# Altium schematic sheet Decoupling Capacitors.SchDoc
size A4
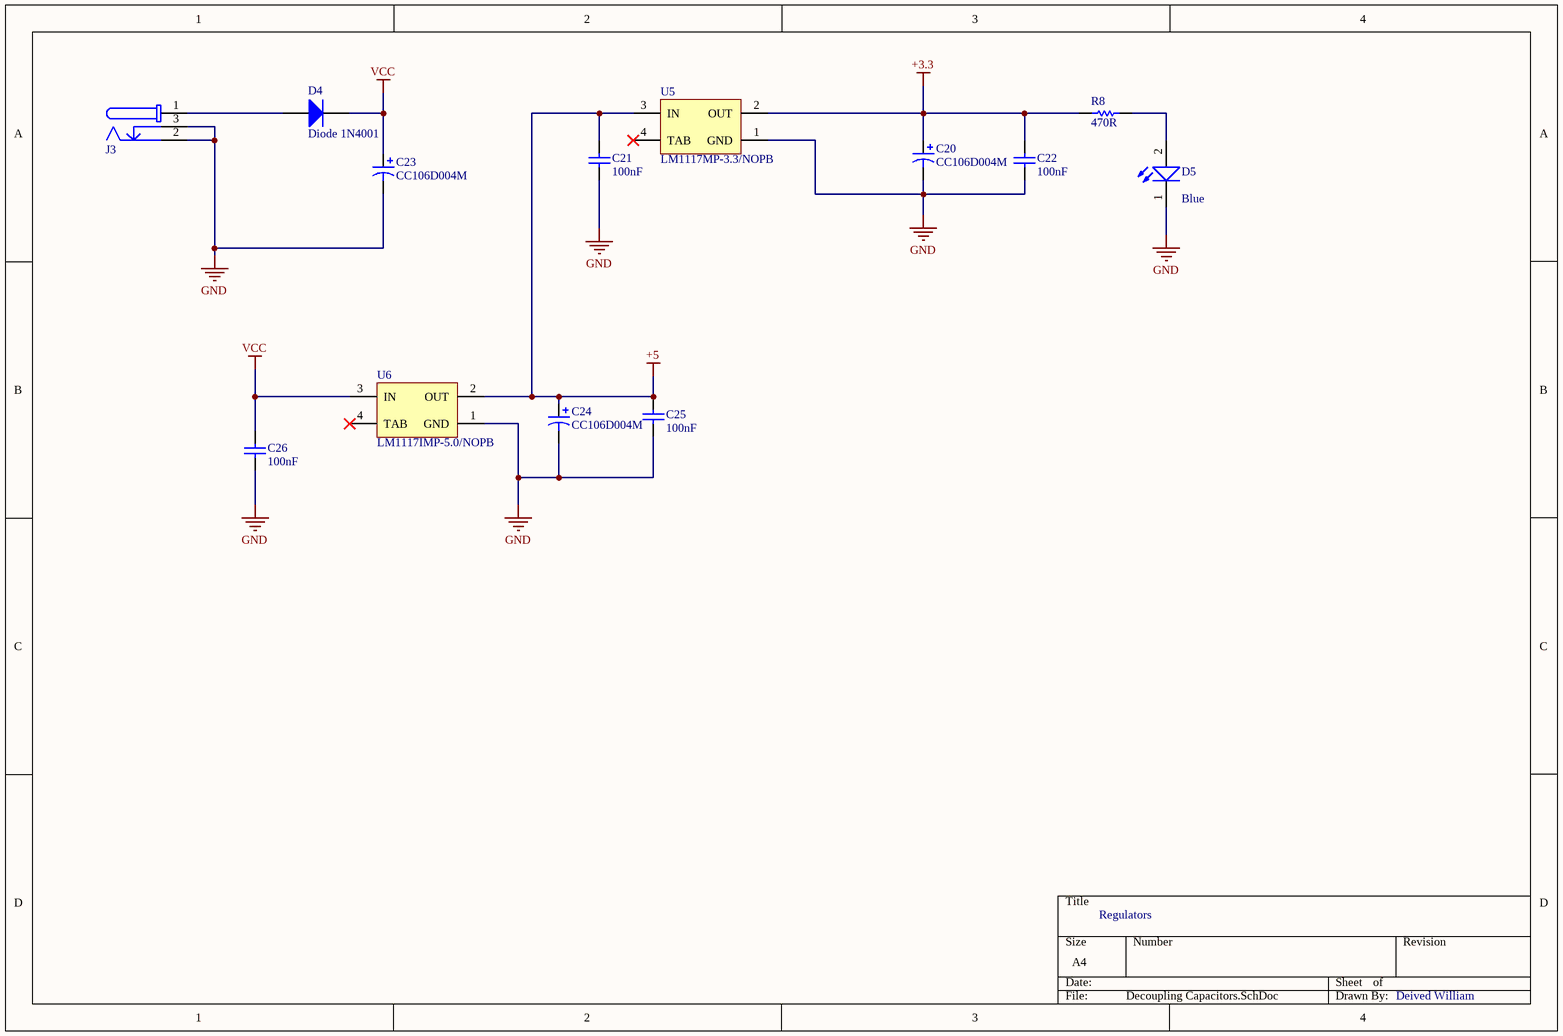
[diagram p0: Decoupling Capacitors.SchDoc]

## Parts
C20  CC106D004M  [D]
C21  value 100nF  [WCAP-CSGP_0603, 1.6x0.8x0.8mm_Reflow]  (hidden comment: 885012206020)
C22  value 100nF  [WCAP-CSGP_0603, 1.6x0.8x0.8mm_Reflow]  (hidden comment: 885012206020)
C23  CC106D004M  [D]
C24  CC106D004M  [D]
C25  value 100nF  [WCAP-CSGP_0603, 1.6x0.8x0.8mm_Reflow]  (hidden comment: 885012206020)
C26  value 100nF  [WCAP-CSGP_0603, 1.6x0.8x0.8mm_Reflow]  (hidden comment: 885012206020)
D4  Diode 1N4001  [DO-41]
D5  Emitting Color: Blue  [WL-SMCW_0805]  (hidden comment: 150080BS75000)
J3  694108301002  [694108301002]  (value not drawn)
R8  470R  [3-0603]
U5  LM1117MP-3.3/NOPB  [MP04A_N]
U6  LM1117IMP-5.0/NOPB  [MP04A_N]

## Nets
+3.3: C20.1 C22.2 R8.1 U5.2(OUT)
+5: C21.2 C24.1 C25.2 U5.3(IN) U6.2(OUT)
GND: C20.2 C21.1 C22.1 C23.2 C24.2 C25.1 C26.1 D5.1(K) J3.2 J3.3 U5.1(GND) U6.1(GND)
VCC: C23.1 C26.2 D4.2(K) U6.3(IN)
NetD4_1: D4.1(A) J3.1
NetD5_2: D5.2(A) R8.2

Not connected (* = marked no-connect by the designer): U5 4(TAB)*; U6 4(TAB)*

## Notes on the sheet
- Regulators
- Deived William

## Library data of the parts
C20 C23 C24 = CC106D004M: Conformal Coated Solid Tantalum Chip Capacitor: Standard Range, 10uF, 20% Tolerance, 4 WVDC @ -55°C to +85°C, Surge = 5V; Note: See Data Sheet for full range of components; Published: 19-Mar-2004; DatasheetDocument: 21-Mar-2002; PackageReference: D; Publisher: Altium Limited; ComponentLink1Description: Manufacturer Link; ComponentLink1URL: http://www.vishay.com/; ComponentLink2Description: Datasheet; ComponentLink2URL: http://www.vishay.com/docs/43017/ccec.pdf; Value: 10uF
C21 C22 C25 C26 = 885012206020: WCAP-CSGP Ceramic Capacitors, size 0603, 1.6x0.8x0.8mm, 10V, X7R, 100nF; Rated Voltage: 10V DC; ComponentLink1Description: Manufacturer; ComponentLink1URL: http://www.we-online.de; ComponentLink2Description: Datasheet; ComponentLink2URL: http://katalog.we-online.de/pbs/datasheet/885012206020.pdf; Part Number: 885012206020; Published Date: June 2017; Publisher: Wurth Elektronik; Size: 0603, 1.6x0.8x0.8mm; Ceramic Type: X7R
D4 = Diode 1N4001: 1 Amp General Purpose Rectifier; Published: 8-Jun-2000; LatestRevisionDate: 17-Jul-2002; LatestRevisionNote: Re-released for DXP Platform.; DatasheetVersion: 1998; PackageVersion: Aug-1999; PackageReference: DO-41; Publisher: Altium Limited; PackageDescription: Diode, Axial; Body 5.2 x 2.7 mm (LxDia. max), Lead Dia. 0.86 mm (max); Code_JEDEC: DO-204-AL; ComponentLink1Description: Manufacturer Link; ComponentLink1URL: http://www.fairchildsemi.com/; ComponentLink2Description: Datasheet; ComponentLink2URL: http://www.fairchildsemi.com/ds/1N%2F1N4001.pdf
D5 = 150080BS75000: WL-SMCW SMD Mono-color Chip LED Waterclear, size 0805, Blue; Forward Voltage: 3.2 V; Viewing Angle: 140°; Peak Wavelength: 465 nm; Published Date: Jan 2017; Publisher: Wurth Elektronik; ComponentLink1Description: Manufacturer; ComponentLink1URL: http://www.we-online.de; ComponentLink2Description: Datasheet; ComponentLink2URL: http://katalog.we-online.de/led/datasheet/150080BS75000.pdf; Part Number: 150080BS75000; Size: 0805
J3 = 694108301002: DC Power Jack Right Angled(6.4) WR-DC; Plug OD: 5.5 mm; Rated Current: 5 A; Working Voltage: 24 VAC; Withstanding Voltage: 500 VAC; Opening Diameter: 6.4 mm; ComponentLink1Description: Manufacturer; ComponentLink1URL: http://www.we-online.de; ComponentLink2Description: Datasheet; ComponentLink2URL: http://katalog.we-online.com/em/datasheet/6941xx301002.pdf; Part Number: 694108301002; Published Date: September 2017; Publisher: Wurth Elektronik
R8 = ERJ3RE: Precision Thick Film Chip Resistor, 10 Ohm to 1M Ohm Range, 1% and 0.5% Tolerance, 0603 Size, 0.063 W; Published: 17-Dec-2003; LatestRevisionDate: 19-Mar-2004; LatestRevisionNote: Silkscreen size reduced.; PackageDocument: Mar-2003; PackageReference: 3-0603; Publisher: Altium Limited; Code_IPC: 1608 [0603]; ComponentLink1Description: Manufacturer Link; ComponentLink1URL: http://www.panasonic.com/industrial/components/resistive_products.htm; ComponentLink2Description: Datasheet; ComponentLink2URL: http://www.panasonic.com/industrial/components/pdf/AOA0000CE2.pdf
U5 = LM1117MP-3.3/NOPB: 800mA Low-Dropout Linear Regulator, 4-pin SOT-223, Pb-Free; Manufacturer: National Semiconductor; PackageTopMarking: XYTT*N05A; PowerWise: N; CompType: LDO IC; Published: 1-Mar-2010; DatasheetVersion: Apr-2006; PackageVersion: revB, Apr-2003; PackageReference: MP04A; Publisher: Altium Limited; PackageDescription: Molded SOT-223, 6.50 x 3.56 x 1.6mm Body, 4 Lead, 2.3mm Pitch; Supplier 1: Digi-Key; Supplier Part Number 1: LM1117MP-3.3TR-ND; Supplier 2: Digi-Key; Supplier Part Number 2: LM1117MP-3.3CT-ND; Supplier 3: Digi-Key; Supplier Part Number 3: LM1117MP-3.3DKR-ND; Supplier 4: Farnell; Supplier Part Number 4: 1469054; PartNumber: LM1117MP-3.3/NOPB; RoHS: Y; PinCount: 4; Code_JEDEC: TO-261-AA; Code_IPC: SOT223-4; ComponentLink1Description: LM1117 Datasheet; ComponentLink1URL: http://www.national.com/ds/LM/LM1117.pdf; ComponentLink2Description: LM1117 Web Page; ComponentLink2URL: http://www.national.com/pf/LM/LM1117.html; ComponentLink3Description: MP04A Package Page; ComponentLink3URL: http://www.national.com/packaging/folders/mp04a.html
U6 = LM1117IMP-5.0/NOPB: 800mA Low-Dropout Linear Regulator, 4-pin SOT-223, Pb-Free; Manufacturer: National Semiconductor; PackageTopMarking: XYTT*N06B; PowerWise: N; CompType: LDO IC; Published: 1-Mar-2010; DatasheetVersion: Apr-2006; PackageVersion: revB, Apr-2003; PackageReference: MP04A; Publisher: Altium Limited; PackageDescription: Molded SOT-223, 6.50 x 3.56 x 1.6mm Body, 4 Lead, 2.3mm Pitch; Supplier 1: Digi-Key; Supplier Part Number 1: LM1117IMP-5.0TR-ND; Supplier 2: Digi-Key; Supplier Part Number 2: LM1117IMP-5.0CT-ND; Supplier 3: Digi-Key; Supplier Part Number 3: LM1117IMP-5.0DKR-ND; Supplier 4: Farnell; Supplier Part Number 4: 1469052; PartNumber: LM1117IMP-5.0/NOPB; RoHS: Y; PinCount: 4; Code_JEDEC: TO-261-AA; Code_IPC: SOT223-4; ComponentLink1Description: LM1117 Datasheet; ComponentLink1URL: http://www.national.com/ds/LM/LM1117.pdf; ComponentLink2Description: LM1117 Web Page; ComponentLink2URL: http://www.national.com/pf/LM/LM1117.html; ComponentLink3Description: MP04A Package Page; ComponentLink3URL: http://www.national.com/packaging/folders/mp04a.html